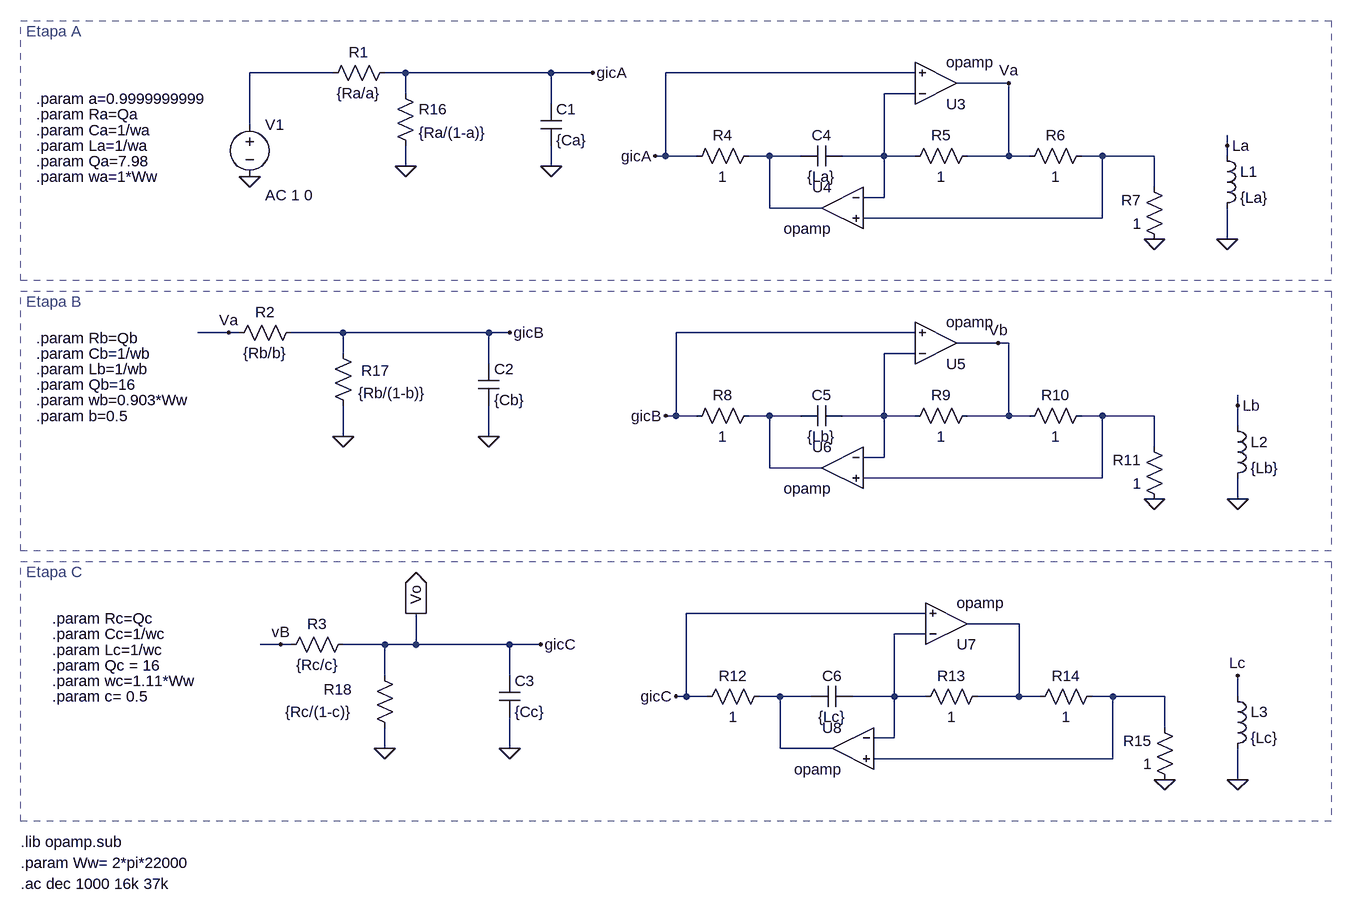
[diagram p0: schematic TS4bisbis_gic.asc]
TS4bisbis_gic.asc, the LTspice schematic file:
Version 4
SHEET 1 3492 1600
WIRE -272 80 -400 80
WIRE -160 80 -192 80
WIRE 64 80 -160 80
WIRE 128 80 64 80
WIRE 624 80 240 80
WIRE 768 96 688 96
WIRE -160 112 -160 80
WIRE 624 112 576 112
WIRE 64 128 64 80
WIRE -400 160 -400 80
WIRE 1104 192 1104 176
WIRE 240 208 240 80
WIRE 240 208 224 208
WIRE 288 208 240 208
WIRE 400 208 368 208
WIRE 448 208 400 208
WIRE 576 208 576 112
WIRE 576 208 512 208
WIRE 624 208 576 208
WIRE 768 208 768 96
WIRE 768 208 704 208
WIRE 800 208 768 208
WIRE 912 208 880 208
WIRE 992 208 912 208
WIRE 1104 208 1104 192
WIRE -160 224 -160 192
WIRE 64 224 64 192
WIRE 992 256 992 208
WIRE 576 272 576 208
WIRE 576 272 544 272
WIRE 400 288 400 208
WIRE 480 288 400 288
WIRE 912 304 912 208
WIRE 912 304 544 304
WIRE 1104 336 1104 288
WIRE -432 480 -480 480
WIRE -416 480 -432 480
WIRE -256 480 -336 480
WIRE -32 480 -256 480
WIRE 0 480 -32 480
WIRE 624 480 256 480
WIRE 752 496 688 496
WIRE 768 496 752 496
WIRE -256 512 -256 480
WIRE 624 512 576 512
WIRE -32 528 -32 480
WIRE 1120 592 1120 576
WIRE 256 608 256 480
WIRE 256 608 240 608
WIRE 288 608 256 608
WIRE 400 608 368 608
WIRE 448 608 400 608
WIRE 576 608 576 512
WIRE 576 608 512 608
WIRE 624 608 576 608
WIRE 768 608 768 496
WIRE 768 608 704 608
WIRE 800 608 768 608
WIRE 912 608 880 608
WIRE 992 608 912 608
WIRE 1120 624 1120 592
WIRE -256 640 -256 592
WIRE -32 640 -32 592
WIRE 992 656 992 608
WIRE 576 672 576 608
WIRE 576 672 544 672
WIRE 400 688 400 608
WIRE 480 688 400 688
WIRE 912 704 912 608
WIRE 912 704 544 704
WIRE 1120 736 1120 704
WIRE 640 912 272 912
WIRE 784 928 704 928
WIRE 640 944 592 944
WIRE -352 960 -384 960
WIRE -336 960 -352 960
WIRE -192 960 -256 960
WIRE -144 960 -144 912
WIRE -144 960 -192 960
WIRE 0 960 -144 960
WIRE 48 960 0 960
WIRE -192 1008 -192 960
WIRE 0 1008 0 960
WIRE 272 1040 272 912
WIRE 272 1040 256 1040
WIRE 304 1040 272 1040
WIRE 416 1040 384 1040
WIRE 464 1040 416 1040
WIRE 592 1040 592 944
WIRE 592 1040 528 1040
WIRE 640 1040 592 1040
WIRE 784 1040 784 928
WIRE 784 1040 720 1040
WIRE 816 1040 784 1040
WIRE 928 1040 896 1040
WIRE 1008 1040 928 1040
WIRE 1120 1040 1120 1008
WIRE 1008 1088 1008 1040
WIRE 592 1104 592 1040
WIRE 592 1104 560 1104
WIRE -192 1120 -192 1088
WIRE 0 1120 0 1072
WIRE 416 1120 416 1040
WIRE 496 1120 416 1120
WIRE 928 1136 928 1040
WIRE 928 1136 560 1136
WIRE 1120 1168 1120 1120
FLAG 1104 336 0
FLAG -400 240 0
FLAG -32 640 0
FLAG 1120 736 0
FLAG -192 1120 0
FLAG 1120 1168 0
FLAG -144 912 Vo
IOPIN -144 912 Out
FLAG 992 336 0
FLAG 992 736 0
FLAG 1008 1168 0
FLAG 240 608 gicB
FLAG 1120 1008 Lc
FLAG 1120 592 Lb
FLAG 1104 192 La
FLAG 128 80 gicA
FLAG 0 480 gicB
FLAG 768 96 Va
FLAG -432 480 Va
FLAG 752 496 Vb
FLAG -352 960 vB
FLAG -256 640 0
FLAG -160 224 0
FLAG 64 224 0
FLAG 224 208 gicA
FLAG 48 960 gicC
FLAG 256 1040 gicC
FLAG 0 1120 0
SYMBOL res -176 64 R90
WINDOW 0 0 56 VBottom 2
WINDOW 3 32 56 VTop 2
SYMATTR InstName R1
SYMATTR Value {Ra/a}
SYMBOL cap 48 128 R0
SYMATTR InstName C1
SYMATTR Value {Ca}
SYMBOL ind 1088 192 R0
SYMATTR InstName L1
SYMATTR Value {La}
SYMBOL voltage -400 144 R0
WINDOW 123 24 124 Left 2
WINDOW 39 0 0 Left 0
SYMATTR Value2 AC 1 0
SYMATTR InstName V1
SYMATTR Value ""
SYMBOL res -320 464 R90
WINDOW 0 0 56 VBottom 2
WINDOW 3 32 56 VTop 2
SYMATTR InstName R2
SYMATTR Value {Rb/b}
SYMBOL cap -48 528 R0
SYMATTR InstName C2
SYMATTR Value {Cb}
SYMBOL ind 1104 608 R0
SYMATTR InstName L2
SYMATTR Value {Lb}
SYMBOL res -240 944 R90
WINDOW 0 0 56 VBottom 2
WINDOW 3 32 56 VTop 2
SYMATTR InstName R3
SYMATTR Value {Rc/c}
SYMBOL cap -16 1008 R0
SYMATTR InstName C3
SYMATTR Value {Cc}
SYMBOL ind 1104 1024 R0
SYMATTR InstName L3
SYMATTR Value {Lc}
SYMBOL OpAmps\\opamp 656 160 M180
SYMATTR InstName U3
SYMBOL OpAmps\\opamp 512 224 M0
SYMATTR InstName U4
SYMBOL res 384 192 R90
WINDOW 0 0 56 VBottom 2
WINDOW 3 32 56 VTop 2
SYMATTR InstName R4
SYMATTR Value 1
SYMBOL res 720 192 R90
WINDOW 0 0 56 VBottom 2
WINDOW 3 32 56 VTop 2
SYMATTR InstName R5
SYMATTR Value 1
SYMBOL res 896 192 R90
WINDOW 0 0 56 VBottom 2
WINDOW 3 32 56 VTop 2
SYMATTR InstName R6
SYMATTR Value 1
SYMBOL res 1008 352 R180
WINDOW 0 36 76 Left 2
WINDOW 3 36 40 Left 2
SYMATTR InstName R7
SYMATTR Value 1
SYMBOL cap 512 192 R90
WINDOW 0 0 32 VBottom 2
WINDOW 3 32 32 VTop 2
SYMATTR InstName C4
SYMATTR Value {La}
SYMBOL OpAmps\\opamp 656 560 M180
SYMATTR InstName U5
SYMBOL OpAmps\\opamp 512 624 M0
SYMATTR InstName U6
SYMBOL res 384 592 R90
WINDOW 0 0 56 VBottom 2
WINDOW 3 32 56 VTop 2
SYMATTR InstName R8
SYMATTR Value 1
SYMBOL res 720 592 R90
WINDOW 0 0 56 VBottom 2
WINDOW 3 32 56 VTop 2
SYMATTR InstName R9
SYMATTR Value 1
SYMBOL res 896 592 R90
WINDOW 0 0 56 VBottom 2
WINDOW 3 32 56 VTop 2
SYMATTR InstName R10
SYMATTR Value 1
SYMBOL res 1008 752 R180
WINDOW 0 36 76 Left 2
WINDOW 3 36 40 Left 2
SYMATTR InstName R11
SYMATTR Value 1
SYMBOL cap 512 592 R90
WINDOW 0 0 32 VBottom 2
WINDOW 3 32 32 VTop 2
SYMATTR InstName C5
SYMATTR Value {Lb}
SYMBOL OpAmps\\opamp 672 992 M180
SYMATTR InstName U7
SYMBOL OpAmps\\opamp 528 1056 M0
SYMATTR InstName U8
SYMBOL res 400 1024 R90
WINDOW 0 0 56 VBottom 2
WINDOW 3 32 56 VTop 2
SYMATTR InstName R12
SYMATTR Value 1
SYMBOL res 736 1024 R90
WINDOW 0 0 56 VBottom 2
WINDOW 3 32 56 VTop 2
SYMATTR InstName R13
SYMATTR Value 1
SYMBOL res 912 1024 R90
WINDOW 0 0 56 VBottom 2
WINDOW 3 32 56 VTop 2
SYMATTR InstName R14
SYMATTR Value 1
SYMBOL res 1024 1184 R180
WINDOW 0 36 76 Left 2
WINDOW 3 36 40 Left 2
SYMATTR InstName R15
SYMATTR Value 1
SYMBOL cap 528 1024 R90
WINDOW 0 0 32 VBottom 2
WINDOW 3 32 32 VTop 2
SYMATTR InstName C6
SYMATTR Value {Lc}
SYMBOL res -272 496 R0
WINDOW 0 44 42 Left 2
WINDOW 3 39 77 Left 2
SYMATTR InstName R17
SYMATTR Value {Rb/(1-b)}
SYMBOL res -208 992 R0
WINDOW 0 -78 37 Left 2
WINDOW 3 -137 72 Left 2
SYMATTR InstName R18
SYMATTR Value {Rc/(1-c)}
SYMBOL res -176 96 R0
SYMATTR InstName R16
SYMATTR Value {Ra/(1-a)}
TEXT -752 1328 Left 2 !.ac dec 1000 16k 37k
TEXT -728 144 Left 2 !.param Ra=Qa
TEXT -728 168 Left 2 !.param Ca=1/wa
TEXT -728 192 Left 2 !.param La=1/wa
TEXT -728 488 Left 2 !.param Rb=Qb
TEXT -728 512 Left 2 !.param Cb=1/wb
TEXT -728 536 Left 2 !.param Lb=1/wb
TEXT -704 920 Left 2 !.param Rc=Qc
TEXT -704 944 Left 2 !.param Cc=1/wc
TEXT -704 968 Left 2 !.param Lc=1/wc
TEXT -728 216 Left 2 !.param Qa=7.98
TEXT -728 240 Left 2 !.param wa=1*Ww
TEXT -728 560 Left 2 !.param Qb=16
TEXT -728 584 Left 2 !.param wb=0.903*Ww
TEXT -704 992 Left 2 !.param Qc = 16
TEXT -704 1016 Left 2 !.param wc=1.11*Ww
TEXT -752 1264 Left 2 !.lib opamp.sub
TEXT -752 1296 Left 2 !.param Ww= 2*pi*22000
TEXT -728 120 Left 2 !.param a=0.9999999999
TEXT -704 1040 Left 2 !.param c= 0.5
TEXT -728 608 Left 2 !.param b=0.5
TEXT -744 16 Left 2 ;Etapa A
TEXT -744 432 Left 2 ;Etapa B
TEXT -744 848 Left 2 ;Etapa C
RECTANGLE Normal 1264 400 -752 0 2
RECTANGLE Normal 1264 816 -752 416 2
RECTANGLE Normal 1264 1232 -752 832 2

The netlist it stands for:
* TS4bisbis_gic.asc
R1 gicA N001 {Ra/a}
C1 gicA 0 {Ca}
L1 La 0 {La}
V1 N001 0 AC 1 0
R2 gicB Va {Rb/b}
C2 gicB 0 {Cb}
L2 Lb 0 {Lb}
R3 gicC Vb {Rc/c}
C3 gicC 0 {Cc}
L3 Lc 0 {Lc}
XU3 N002 gicA Va opamp Aol=100K GBW=10Meg  ; pins invin noninvin out
XU4 N002 N004 N003 opamp Aol=100K GBW=10Meg  ; pins invin noninvin out
R4 N003 gicA 1
R5 Va N002 1
R6 N004 Va 1
R7 0 N004 1
C4 N002 N003 {La}
XU5 N005 gicB Vb opamp Aol=100K GBW=10Meg  ; pins invin noninvin out
XU6 N005 N007 N006 opamp Aol=100K GBW=10Meg  ; pins invin noninvin out
R8 N006 gicB 1
R9 Vb N005 1
R10 N007 Vb 1
R11 0 N007 1
C5 N005 N006 {Lb}
XU7 N009 gicC N008 opamp Aol=100K GBW=10Meg  ; pins invin noninvin out
XU8 N009 N011 N010 opamp Aol=100K GBW=10Meg  ; pins invin noninvin out
R12 N010 gicC 1
R13 N008 N009 1
R14 N011 N008 1
R15 0 N011 1
C6 N009 N010 {Lc}
R17 gicB 0 {Rb/(1-b)}
R18 gicC 0 {Rc/(1-c)}
R16 gicA 0 {Ra/(1-a)}
.ac dec 1000 16k 37k
.param Ra=Qa
.param Ca=1/wa
.param La=1/wa
.param Rb=Qb
.param Cb=1/wb
.param Lb=1/wb
.param Rc=Qc
.param Cc=1/wc
.param Lc=1/wc
.param Qa=7.98
.param wa=1*Ww
.param Qb=16
.param wb=0.903*Ww
.param Qc = 16
.param wc=1.11*Ww
.lib opamp.sub
.param Ww= 2*pi*22000
.param a=0.9999999999
.param c= 0.5
.param b=0.5
* Etapa A
* Etapa B
* Etapa C
.backanno
.end